# Altium schematic sheet MCU_JTAG.SchDoc
size A4
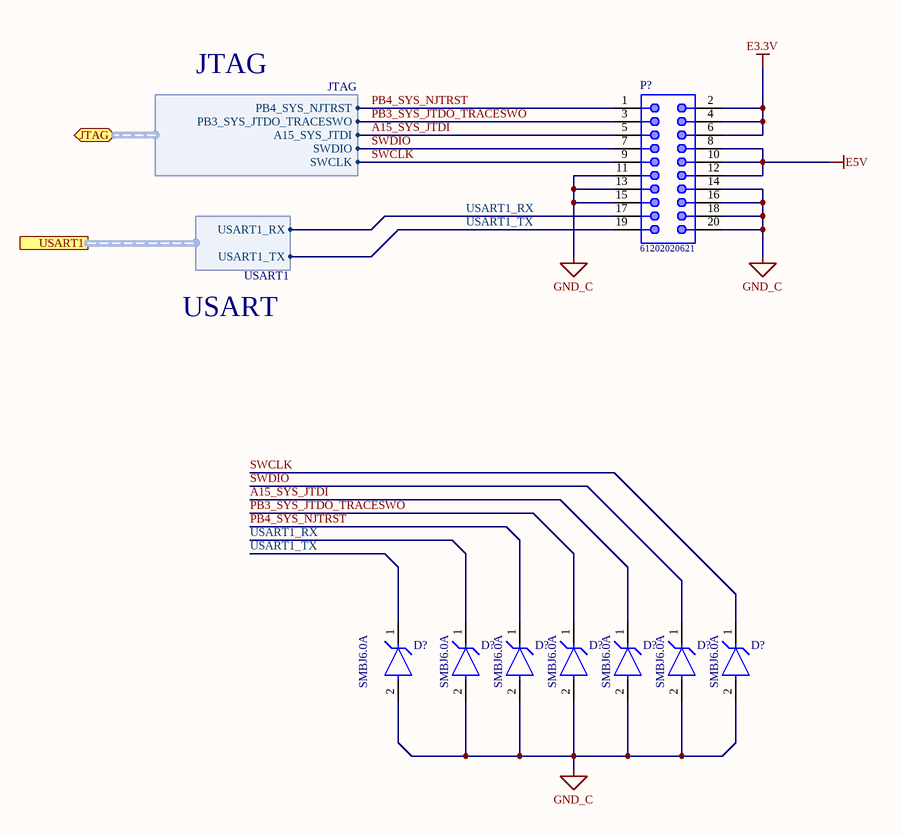
[diagram p0: MCU_JTAG.SchDoc]

## Parts
(Parts that share a designator on the sheet are numbered #1, #2 ... from top to bottom, then left to right.)
D?#1  SMBJ6.0A  [FP-SMBJ-MFG]
D?#2  SMBJ6.0A  [FP-SMBJ-MFG]
D?#3  SMBJ6.0A  [FP-SMBJ-MFG]
D?#4  SMBJ6.0A  [FP-SMBJ-MFG]
D?#5  SMBJ6.0A  [FP-SMBJ-MFG]
D?#6  SMBJ6.0A  [FP-SMBJ-MFG]
D?#7  SMBJ6.0A  [FP-SMBJ-MFG]
P?  61202020621  [61202020621]

## Ports
JTAG (bidir, harness JTAG), USART1 (harness USART1)

## Harnesses
JTAG: PB3_SYS_JTDO_TRACESWO, PB4_SYS_NJTRST, SWDIO, SWCLK, A15_SYS_JTDI
USART1: USART1_RX, USART1_TX

## Nets
E3.3V: P?.2 P?.4 P?.6
E5V: P?.8 P?.10 P?.12
GND_C: D?#1.2(A) D?#2.2(A) D?#3.2(A) D?#4.2(A) D?#5.2(A) D?#6.2(A) D?#7.2(A) P?.11 P?.13 P?.14 P?.15 P?.16 P?.18 P?.20
A15_SYS_JTDI: D?#5.1(C) P?.5 ; port JTAG.A15_SYS_JTDI
PB3_SYS_JTDO_TRACESWO: D?#4.1(C) P?.3 ; port JTAG.PB3_SYS_JTDO_TRACESWO
PB4_SYS_NJTRST: D?#3.1(C) P?.1 ; port JTAG.PB4_SYS_NJTRST
SWCLK: D?#7.1(C) P?.9 ; port JTAG.SWCLK
SWDIO: D?#6.1(C) P?.7 ; port JTAG.SWDIO
USART1_RX: D?#2.1(C) P?.17 ; port USART1.USART1_RX
USART1_TX: D?#1.1(C) P?.19 ; port USART1.USART1_TX

## Notes on the sheet
- JTAG
- USART

## Library data of the parts
D?#1-D?#7 = CMP-08607-000069-1: TVS DIODE 6V 10.3V DO214AA; Manufacturer: Littelfuse Inc; Breakdown Voltage: 6.67V; Direction: Unidirectional; Number Of Channels: 1; Peak Pulse Power: 600W; Peak Pulse Current: 58.3A; Max Junction Temp: +150°C; Category: Diode; ComponentLink2Description: Datasheet; Octopart: https://octopart.com/smbj6.0a-littelfuse-66100; Clamping Voltage: 10.3V; Device Class L3: unset; Temperature Range Low: -65°C; Temperature: -65°C to +150°C; ComponentLink2URL: https://www.littelfuse.com/~/media/electronics/datasheets/tvs_diodes/littelfuse_tvs_diode_smbj_datasheet.pdf.pdf; Height: 2.61mm; Digikey Description: TVS DIODE 6V 10.3V DO214AA; Manufacturer Part Number: SMBJ6.0A; Temperature Range High: +150°C; Device Class L2: TVS Diodes; Mouser Description: In a Pack of 10, Littelfuse SMBJ6.0A, Uni-Directional TVS Diode, 600W, 2-Pin DO-214AA; Automotive: No; RoHS: TRUE; Device Class L1: Circuit Protection; Reverse Standoff Voltage: 6V; Lead Free: Yes; Package: SMBJ
P? = 61202020621: Male Box Header WR-BHD, SMT, Vertical, pitch 2.54 mm, 20 pins; Pitch: 2.54 mm; Working Voltage: 250 VAC; Withstanding Voltage: 500 VAC; Contact Resistance: 20 mOhm; Pin Number: 20; ComponentLink1Description: Manufacturer; ComponentLink1URL: http://www.we-online.de; ComponentLink2Description: Datasheet; ComponentLink2URL: https://katalog.we-online.de/em/datasheet/6120xx20621.pdf; Part Number: 61202020621; Published Date: August 2018; Publisher: Wurth Elektronik; Operating Temperature: -40 to 125 degC; Packaging: Tube; Gender: Male; Mounting Technology: SMT; Orientation: Vertical